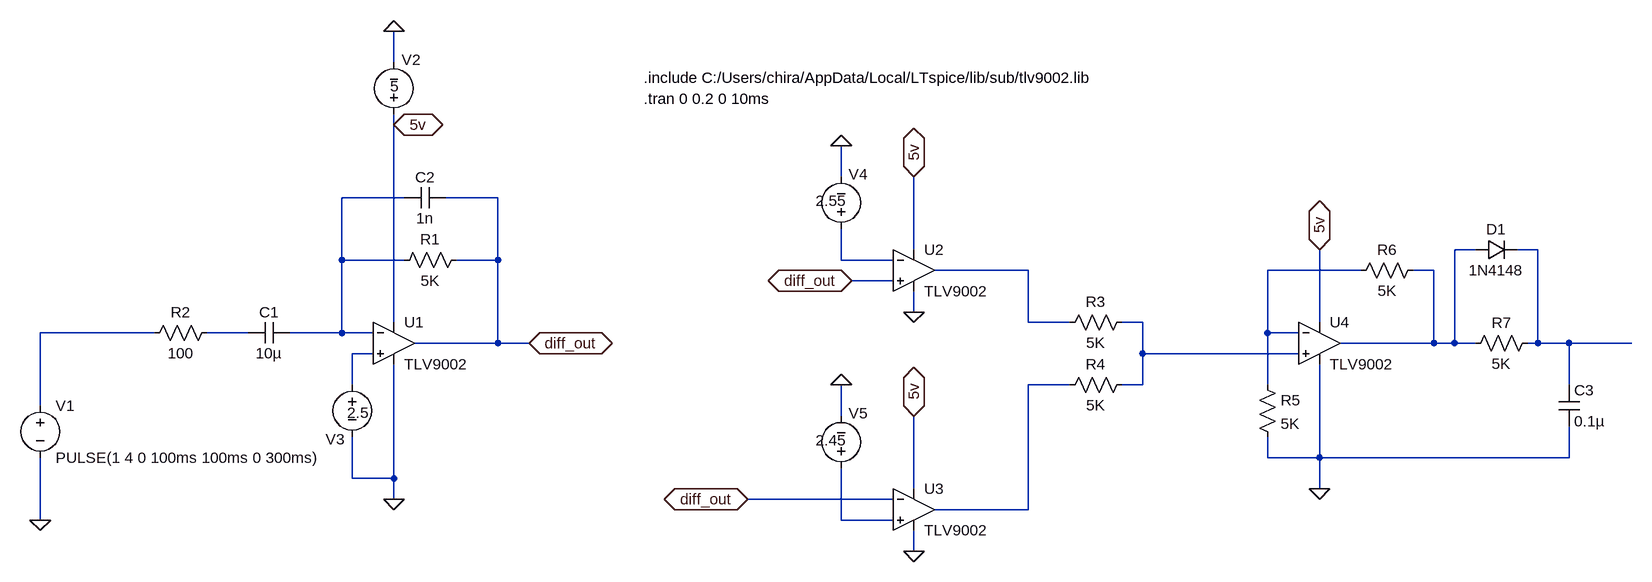
[diagram p0: schematic differentiator.asc]
differentiator.asc, the LTspice schematic file:
Version 4.1
SHEET 1 2632 680
WIRE 560 -400 560 -448
WIRE 560 -304 560 -320
WIRE 1248 -224 1248 -272
WIRE 576 -192 480 -192
WIRE 720 -192 640 -192
WIRE 1360 -112 1360 -224
WIRE 2224 -112 2192 -112
WIRE 2320 -112 2288 -112
WIRE 480 -96 480 -192
WIRE 576 -96 480 -96
WIRE 720 -96 720 -192
WIRE 720 -96 656 -96
WIRE 1248 -96 1248 -144
WIRE 1328 -96 1248 -96
WIRE 1536 -80 1392 -80
WIRE 2048 -80 1904 -80
WIRE 2160 -80 2128 -80
WIRE 1328 -64 1264 -64
WIRE 1360 -16 1360 -48
WIRE 560 0 560 -304
WIRE 1536 0 1536 -80
WIRE 1600 0 1536 0
WIRE 1712 0 1680 0
WIRE 1984 0 1984 -112
WIRE 192 16 16 16
WIRE 336 16 272 16
WIRE 480 16 480 -96
WIRE 480 16 400 16
WIRE 528 16 480 16
WIRE 1904 16 1904 -80
WIRE 1952 16 1904 16
WIRE 720 32 720 -96
WIRE 720 32 592 32
WIRE 768 32 720 32
WIRE 2160 32 2160 -80
WIRE 2160 32 2016 32
WIRE 2192 32 2192 -112
WIRE 2192 32 2160 32
WIRE 2224 32 2192 32
WIRE 2320 32 2320 -112
WIRE 2320 32 2304 32
WIRE 2368 32 2320 32
WIRE 2464 32 2368 32
WIRE 528 48 496 48
WIRE 1712 48 1712 0
WIRE 1952 48 1712 48
WIRE 496 96 496 48
WIRE 1600 96 1536 96
WIRE 1712 96 1712 48
WIRE 1712 96 1680 96
WIRE 1904 96 1904 16
WIRE 2368 96 2368 32
WIRE 16 128 16 16
WIRE 1248 144 1248 96
WIRE 1904 208 1904 176
WIRE 1984 208 1984 64
WIRE 1984 208 1904 208
WIRE 2368 208 2368 160
WIRE 2368 208 1984 208
WIRE 496 240 496 176
WIRE 560 240 560 64
WIRE 560 240 496 240
WIRE 1360 256 1360 144
WIRE 1984 256 1984 208
WIRE 560 272 560 240
WIRE 1328 272 1104 272
WIRE 1536 288 1536 96
WIRE 1536 288 1392 288
WIRE 16 304 16 208
WIRE 1248 304 1248 224
WIRE 1328 304 1248 304
WIRE 1360 352 1360 320
FLAG 16 304 0
FLAG 560 -448 0
FLAG 560 272 0
FLAG 1360 -16 0
FLAG 768 32 diff_out
IOPIN 768 32 BiDir
FLAG 1264 -64 diff_out
IOPIN 1264 -64 BiDir
FLAG 560 -304 5v
IOPIN 560 -304 BiDir
FLAG 1360 -224 5v
IOPIN 1360 -224 BiDir
FLAG 1248 -272 0
FLAG 1360 352 0
FLAG 1104 272 diff_out
IOPIN 1104 272 BiDir
FLAG 1360 144 5v
IOPIN 1360 144 BiDir
FLAG 1248 96 0
FLAG 1984 -112 5v
IOPIN 1984 -112 BiDir
FLAG 1984 256 0
SYMBOL voltage 16 112 R0
WINDOW 123 0 0 Left 0
WINDOW 39 0 0 Left 0
SYMATTR InstName V1
SYMATTR Value PULSE(1 4 0 100ms 100ms 0 300ms)
SYMBOL res 560 -80 R270
WINDOW 0 32 56 VTop 2
WINDOW 3 0 56 VBottom 2
SYMATTR InstName R1
SYMATTR Value 5K
SYMBOL voltage 560 -304 R180
WINDOW 0 -41 100 Left 2
WINDOW 3 -8 59 Left 2
WINDOW 123 0 0 Left 0
WINDOW 39 0 0 Left 0
SYMATTR InstName V2
SYMATTR Value 5
SYMBOL OpAmps\\TLV9002 560 -32 R0
SYMATTR InstName U1
SYMBOL cap 400 0 R90
WINDOW 0 0 32 VBottom 2
WINDOW 3 32 32 VTop 2
SYMATTR InstName C1
SYMATTR Value 10µ
SYMATTR SpiceLine V=10 Irms=0 Rser=0.0099 Lser=328p
SYMBOL voltage 496 80 R0
WINDOW 0 -41 100 Left 2
WINDOW 3 -8 59 Left 2
WINDOW 123 0 0 Left 0
WINDOW 39 0 0 Left 0
SYMATTR InstName V3
SYMATTR Value 2.5
SYMBOL res 176 32 R270
WINDOW 0 32 56 VTop 2
WINDOW 3 0 56 VBottom 2
SYMATTR InstName R2
SYMATTR Value 100
SYMBOL cap 640 -208 R90
WINDOW 0 0 32 VBottom 2
WINDOW 3 32 32 VTop 2
SYMATTR InstName C2
SYMATTR Value 1n
SYMATTR SpiceLine V=10 Irms=0 Rser=0.0099 Lser=328p
SYMBOL OpAmps\\TLV9002 1360 -144 R0
SYMATTR InstName U2
SYMBOL voltage 1248 -128 R180
WINDOW 0 -41 100 Left 2
WINDOW 3 -8 59 Left 2
WINDOW 123 0 0 Left 0
WINDOW 39 0 0 Left 0
SYMATTR InstName V4
SYMATTR Value 2.55
SYMBOL OpAmps\\TLV9002 1360 224 R0
SYMATTR InstName U3
SYMBOL voltage 1248 240 R180
WINDOW 0 -41 100 Left 2
WINDOW 3 -8 59 Left 2
WINDOW 123 0 0 Left 0
WINDOW 39 0 0 Left 0
SYMATTR InstName V5
SYMATTR Value 2.45
SYMBOL res 1584 16 R270
WINDOW 0 32 56 VTop 2
WINDOW 3 0 56 VBottom 2
SYMATTR InstName R3
SYMATTR Value 5K
SYMBOL res 1584 112 R270
WINDOW 0 32 56 VTop 2
WINDOW 3 0 56 VBottom 2
SYMATTR InstName R4
SYMATTR Value 5K
SYMBOL OpAmps\\TLV9002 1984 -32 R0
SYMATTR InstName U4
SYMBOL res 1888 80 R0
SYMATTR InstName R5
SYMATTR Value 5K
SYMBOL res 2144 -96 R90
WINDOW 0 0 56 VBottom 2
WINDOW 3 32 56 VTop 2
SYMATTR InstName R6
SYMATTR Value 5K
SYMBOL cap 2352 96 R0
SYMATTR InstName C3
SYMATTR Value 0.1µ
SYMATTR SpiceLine V=10 Irms=0 Rser=0.0099 Lser=328p
SYMBOL res 2208 48 R270
WINDOW 0 32 56 VTop 2
WINDOW 3 0 56 VBottom 2
SYMATTR InstName R7
SYMATTR Value 5K
SYMBOL diode 2224 -96 R270
WINDOW 0 32 32 VTop 2
WINDOW 3 0 32 VBottom 2
SYMATTR InstName D1
SYMATTR Value 1N4148
TEXT 944 -344 Left 2 !.tran 0 0.2 0 10ms
TEXT 944 -376 Left 2 !.include C:/Users/chira/AppData/Local/LTspice/lib/sub/tlv9002.lib

The netlist it stands for:
* differentiator.asc
V1 N008 0 PULSE(1 4 0 100ms 100ms 0 300ms)
R1 N001 diff_out 5K
V2 5v 0 5
X§U1 N010 N001 5v 0 diff_out TLV9002  ; pins In+ In- V+ V- OUT
C1 N001 N009 10µ V=10 Irms=0 Rser=0.0099 Lser=328p
V3 N010 0 2.5
R2 N008 N009 100
C2 diff_out N001 1n V=10 Irms=0 Rser=0.0099 Lser=328p
X§U2 diff_out N004 5v 0 N005 TLV9002  ; pins In+ In- V+ V- OUT
V4 N004 0 2.55
X§U3 N012 diff_out 5v 0 N011 TLV9002  ; pins In+ In- V+ V- OUT
V5 N012 0 2.45
R3 N005 N007 5K
R4 N011 N007 5K
X§U4 N007 N006 5v 0 N002 TLV9002  ; pins In+ In- V+ V- OUT
R5 N006 0 5K
R6 N002 N006 5K
C3 N003 0 0.1µ V=10 Irms=0 Rser=0.0099 Lser=328p
R7 N002 N003 5K
D1 N002 N003 1N4148
.model D D
.lib standard.dio
.tran 0 0.2 0 10ms
.include C:/Users/chira/AppData/Local/LTspice/lib/sub/tlv9002.lib
.backanno
.end